# EAGLE design Mixer-Analog-OPA4134-Rev-M-multi (EAGLE 8.6.0)
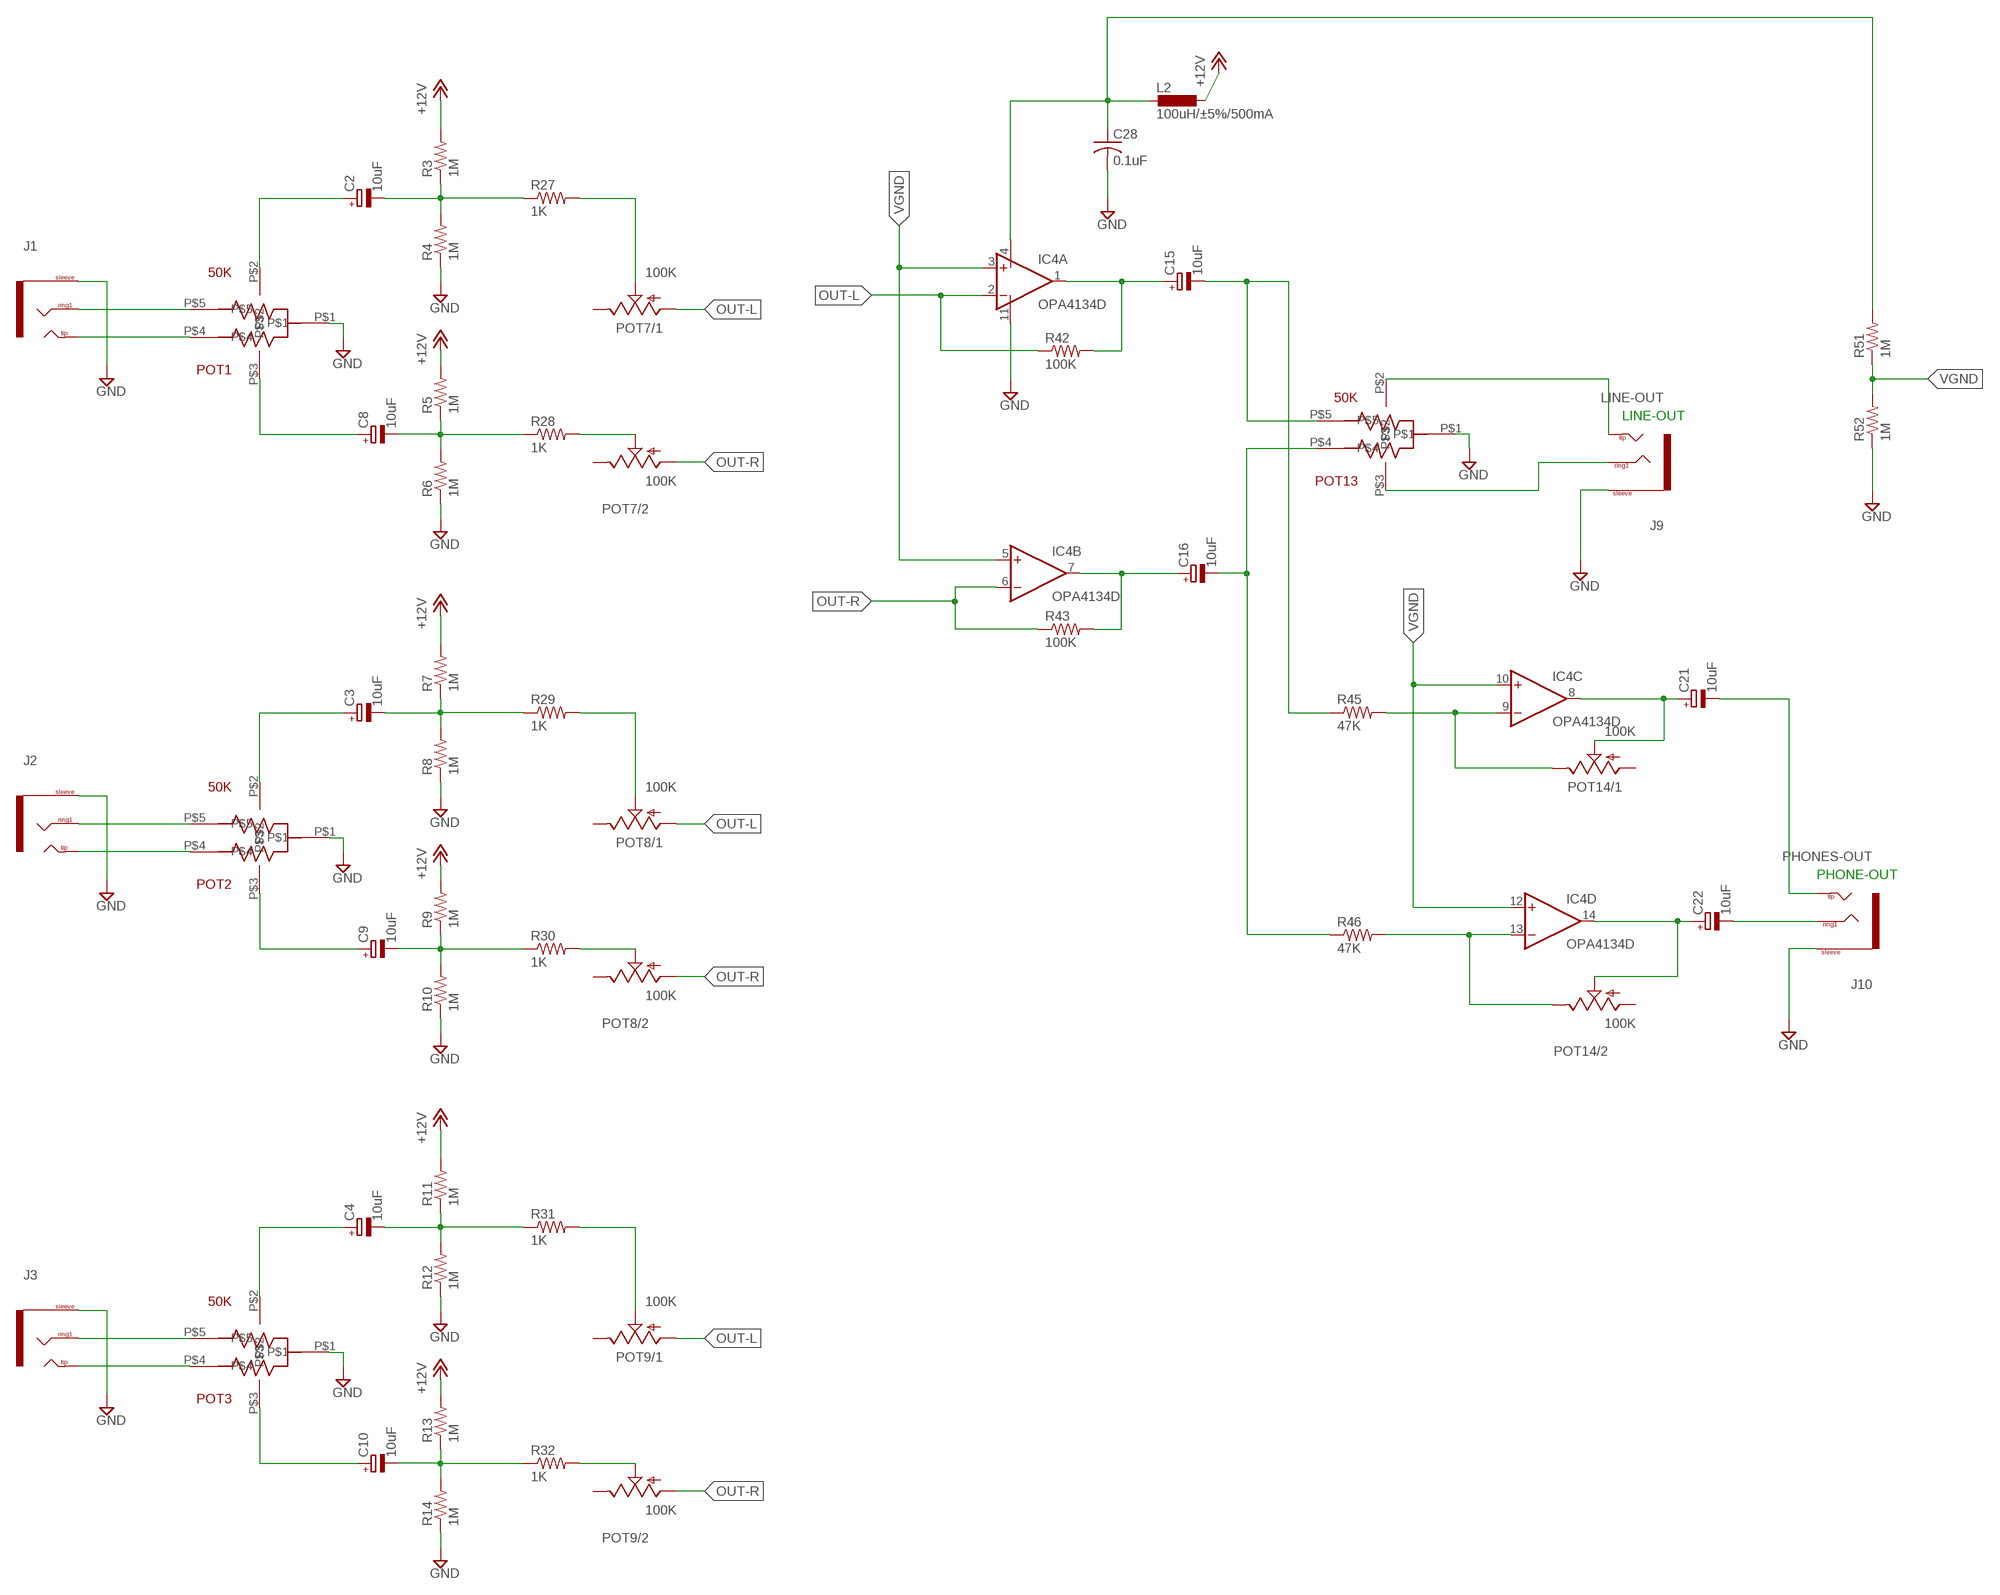
[diagram p0: schematic, sheet 1, part 1 of 2]
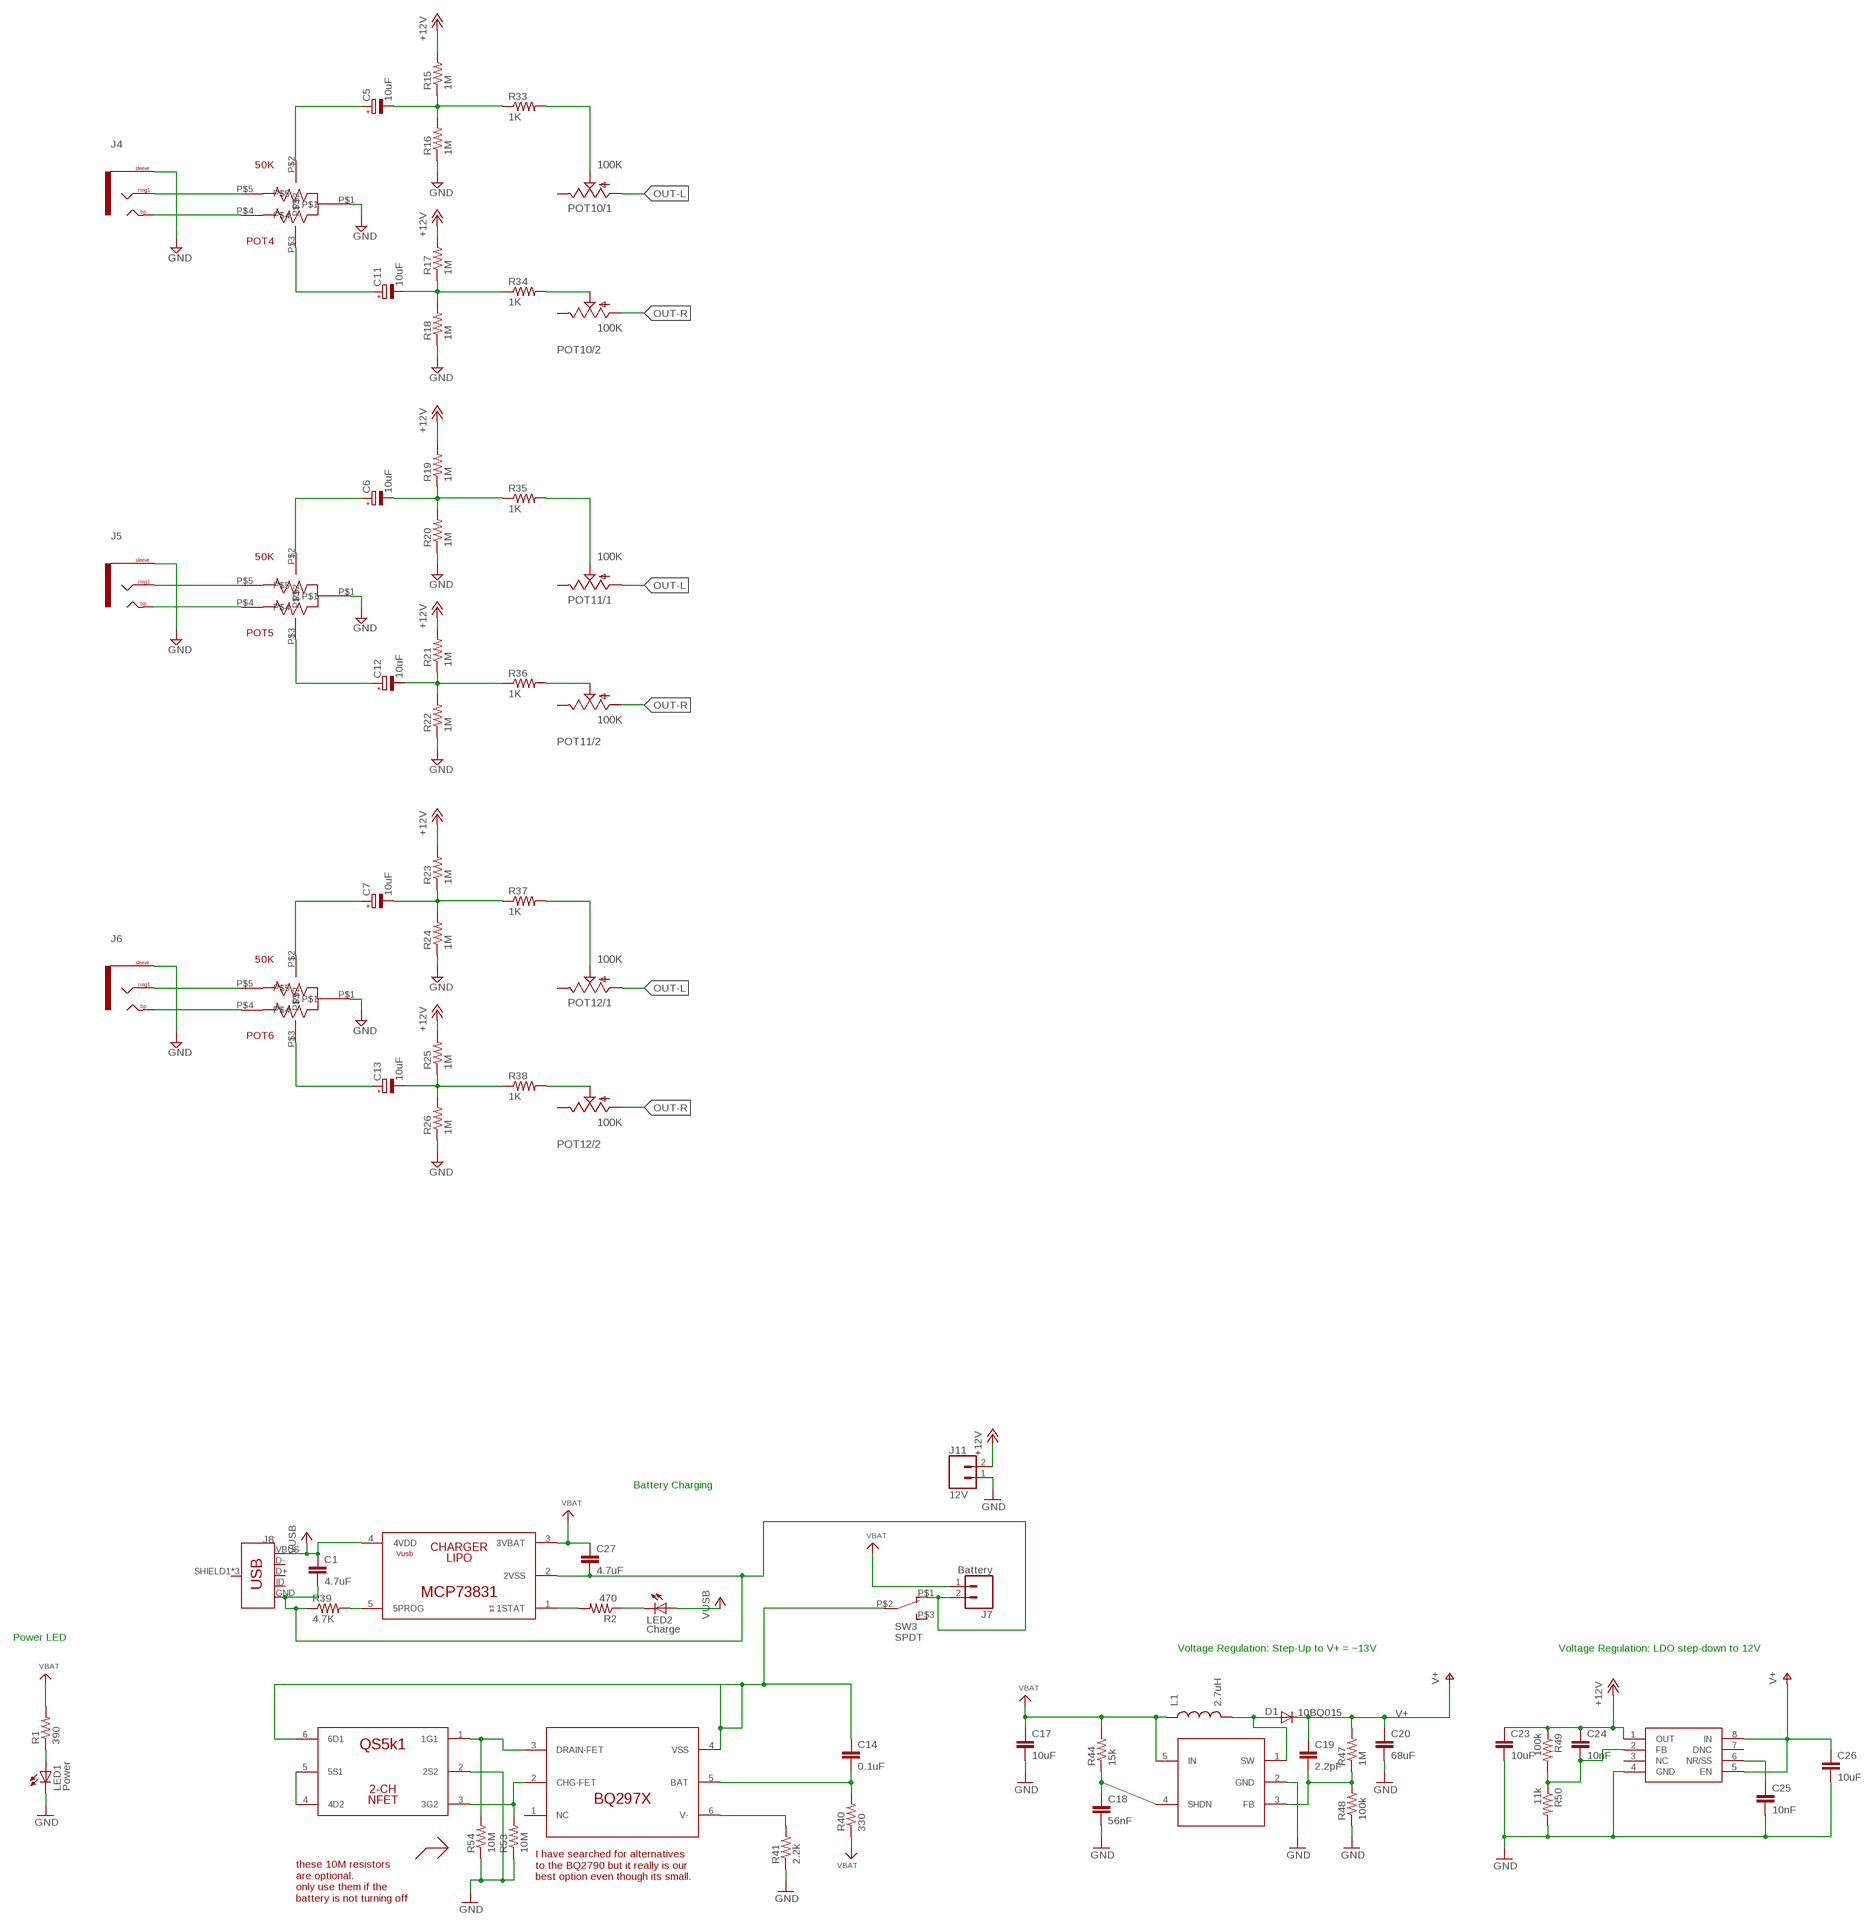
[diagram p1: schematic, sheet 1, part 2 of 2]

## Parts
C1  4.7uF  C-EUC0603  [C0603]
C2  10uF  CPOL-EUB  [PANASONIC_B]
C3  10uF  CPOL-EUB  [PANASONIC_B]
C4  10uF  CPOL-EUB  [PANASONIC_B]
C5  10uF  CPOL-EUB  [PANASONIC_B]
C6  10uF  CPOL-EUB  [PANASONIC_B]
C7  10uF  CPOL-EUB  [PANASONIC_B]
C8  10uF  CPOL-EUB  [PANASONIC_B]
C9  10uF  CPOL-EUB  [PANASONIC_B]
C10  10uF  CPOL-EUB  [PANASONIC_B]
C11  10uF  CPOL-EUB  [PANASONIC_B]
C12  10uF  CPOL-EUB  [PANASONIC_B]
C13  10uF  CPOL-EUB  [PANASONIC_B]
C14  0.1uF  C-EUC0603  [C0603]
C15  10uF  CPOL-EUB  [PANASONIC_B]
C16  10uF  CPOL-EUB  [PANASONIC_B]
C17  10uF  C-EUC0603  [C0603]
C18  56nF  C-EUC0603  [C0603]
C19  2.2pF  C-EUC0603  [C0603]
C20  68uF  C-EUC1206  [C1206]
C21  10uF  CPOL-EUB  [PANASONIC_B]
C22  10uF  CPOL-EUB  [PANASONIC_B]
C23  10uF  C-EUC0603  [C0603]
C24  10nF  C-EUC0603  [C0603]
C25  10nF  C-EUC0603  [C0603]
C26  10uF  C-EUC0603  [C0603]
C27  4.7uF  C-EUC0603  [C0603]
C28  0.1uF  C-USC0805K  [C0805K]
D1  10BQ015  DIODESMA  [SMA-DIODE]
IC1  BQ297X  BQ297X-BATTERY-MANAGERLONG  [WSON-6-LONG]
IC2  MCP73831  [SOT-23-5]
IC3  QS6K1  [SOT457R_PHILIPS]
IC4  OPA4134D  [SO14]
IC5  SC4503  [SOT23-5]
IC6  TPS7A49  [MSOP-8]
J1  TRS-1/8"-3.5MM  [TRS_SJ-3524-SMT]
J2  TRS-1/8"-3.5MM  [TRS_SJ-3524-SMT]
J3  TRS-1/8"-3.5MM  [TRS_SJ-3524-SMT]
J4  TRS-1/8"-3.5MM  [TRS_SJ-3524-SMT]
J5  TRS-1/8"-3.5MM  [TRS_SJ-3524-SMT]
J6  TRS-1/8"-3.5MM  [TRS_SJ-3524-SMT]
J7  Battery  CONN_02LOCK  [1X02_LOCK]
J8  USB_MICRO-BREDUCED_PASTE  [USB-B-MICRO-SMD_RED_PASTE]
J9  LINE-OUT  TRS-1/8"-3.5MM  [TRS_SJ-3524-SMT]
J10  PHONES-OUT  TRS-1/8"-3.5MM  [TRS_SJ-3524-SMT]
J11  12V  CONN_02LOCK  [1X02_LOCK]
L1  2.7uH  INDUCTORCR54-KIT  [CR54-KIT]
L2  100uH/±5%/500mA  L-EUL3225M  [L3225M]
LED1  Power  LED3MM  [LED3MM]
LED2  Charge  LED3MM  [LED3MM]
POT1  50K  POT-DUAL-ALPS-RK10J12E0A0A  [POT-DUAL-ALPS-RK10J12E0A0A]
POT2  50K  POT-DUAL-ALPS-RK10J12E0A0A  [POT-DUAL-ALPS-RK10J12E0A0A]
POT3  50K  POT-DUAL-ALPS-RK10J12E0A0A  [POT-DUAL-ALPS-RK10J12E0A0A]
POT4  50K  POT-DUAL-ALPS-RK10J12E0A0A  [POT-DUAL-ALPS-RK10J12E0A0A]
POT5  50K  POT-DUAL-ALPS-RK10J12E0A0A  [POT-DUAL-ALPS-RK10J12E0A0A]
POT6  50K  POT-DUAL-ALPS-RK10J12E0A0A  [POT-DUAL-ALPS-RK10J12E0A0A]
POT7  100K  POT-DUAL-PTV112-4420  [PTV112]
POT8  100K  POT-DUAL-PTV112-4420  [PTV112]
POT9  100K  POT-DUAL-PTV112-4420  [PTV112]
POT10  100K  POT-DUAL-PTV112-4420  [PTV112]
POT11  100K  POT-DUAL-PTV112-4420  [PTV112]
POT12  100K  POT-DUAL-PTV112-4420  [PTV112]
POT13  50K  POT-DUAL-ALPS-RK10J12E0A0A  [POT-DUAL-ALPS-RK10J12E0A0A]
POT14  100K  POT-DUAL-PTV112-4420  [PTV112]
R1  390  R-US_R0603  [R0603]
R2  470  R-US_R0603  [R0603]
R3  1M  RESISTOR0603-RES  [0603-RES]
R4  1M  RESISTOR0603-RES  [0603-RES]
R5  1M  RESISTOR0603-RES  [0603-RES]
R6  1M  RESISTOR0603-RES  [0603-RES]
R7  1M  RESISTOR0603-RES  [0603-RES]
R8  1M  RESISTOR0603-RES  [0603-RES]
R9  1M  RESISTOR0603-RES  [0603-RES]
R10  1M  RESISTOR0603-RES  [0603-RES]
R11  1M  RESISTOR0603-RES  [0603-RES]
R12  1M  RESISTOR0603-RES  [0603-RES]
R13  1M  RESISTOR0603-RES  [0603-RES]
R14  1M  RESISTOR0603-RES  [0603-RES]
R15  1M  RESISTOR0603-RES  [0603-RES]
R16  1M  RESISTOR0603-RES  [0603-RES]
R17  1M  RESISTOR0603-RES  [0603-RES]
R18  1M  RESISTOR0603-RES  [0603-RES]
R19  1M  RESISTOR0603-RES  [0603-RES]
R20  1M  RESISTOR0603-RES  [0603-RES]
R21  1M  RESISTOR0603-RES  [0603-RES]
R22  1M  RESISTOR0603-RES  [0603-RES]
R23  1M  RESISTOR0603-RES  [0603-RES]
R24  1M  RESISTOR0603-RES  [0603-RES]
R25  1M  RESISTOR0603-RES  [0603-RES]
R26  1M  RESISTOR0603-RES  [0603-RES]
R27  1K  RESISTOR0603-RES  [0603-RES]
R28  1K  RESISTOR0603-RES  [0603-RES]
R29  1K  RESISTOR0603-RES  [0603-RES]
R30  1K  RESISTOR0603-RES  [0603-RES]
R31  1K  RESISTOR0603-RES  [0603-RES]
R32  1K  RESISTOR0603-RES  [0603-RES]
R33  1K  RESISTOR0603-RES  [0603-RES]
R34  1K  RESISTOR0603-RES  [0603-RES]
R35  1K  RESISTOR0603-RES  [0603-RES]
R36  1K  RESISTOR0603-RES  [0603-RES]
R37  1K  RESISTOR0603-RES  [0603-RES]
R38  1K  RESISTOR0603-RES  [0603-RES]
R39  4.7K  R-US_R0603  [R0603]
R40  330  R-US_R0603  [R0603]
R41  2.2k  R-US_R0603  [R0603]
R42  100K  RESISTOR0603-RES  [0603-RES]
R43  100K  RESISTOR0603-RES  [0603-RES]
R44  15k  R-US_R0603  [R0603]
R45  47K  RESISTOR0603-RES  [0603-RES]
R46  47K  RESISTOR0603-RES  [0603-RES]
R47  1M  R-US_R0603  [R0603]
R48  100k  R-US_R0603  [R0603]
R49  100k  R-US_R0603  [R0603]
R50  11k  R-US_R0603  [R0603]
R51  1M  RESISTOR0603-RES  [0603-RES]
R52  1M  RESISTOR0603-RES  [0603-RES]
R53  10M  R-US_R0603  [R0603]
R54  10M  R-US_R0603  [R0603]
SW3  SPDT  SWITCH_SPDTCL-SB-12B  [SWITCH_SPDT_CL-SB-12B]

## Nets
+5V: C1.1 IC2.4(4VDD) J8.VBUS LED2.A ; supply symbol labelled VUSB
+12V: C23.1 C24.1 IC6.1(OUT) J11.2 L2.1 R3.2 R5.2 R7.2 R9.2 R11.2 R13.2 R15.2 R17.2 R19.2 R21.2 R23.2 R25.2 R49.1
BATGND: C14.1 IC1.4(VSS) IC3.6(6D1) SW3.P$2
GND: C17.2 C18.2 C20.2 C23.2 C25.2 C26.2 C28.2 IC3.2(2S2) IC4.11(P:V-) IC6.4(GND) J1.1(SLEEVE) J2.1(SLEEVE) J3.1(SLEEVE) J4.1(SLEEVE) J5.1(SLEEVE) J6.1(SLEEVE) J9.1(SLEEVE) J10.1(SLEEVE) J11.1 LED1.K(C) POT1.P$1 POT2.P$1 POT3.P$1 POT4.P$1 POT5.P$1 POT6.P$1 POT13.P$1 R4.1 R6.1 R8.1 R10.1 R12.1 R14.1 R16.1 R18.1 R20.1 R22.1 R24.1 R26.1 R41.1 R48.1 R50.2 R52.1 R53.1 R54.1
N$1: C8.+ POT1.P$3
N$2: LED2.K(C) R2.1
N$3: C8.- R5.1 R6.2 R28.1
N$4: C14.2 IC1.5(BAT) R40.2
N$5: J1.3(RING1) POT1.P$5
N$6: IC2.5(5PROG) R39.2
N$7: C15.+ IC4.1(A:OUT) R42.2
N$8: C2.+ POT1.P$2
N$9: J1.2(TIP) J1.4(TIP) POT1.P$4
N$10: IC2.1(1STAT) R2.2
N$11: IC3.4(4D2) IC3.5(5S1)
N$12: IC1.3(DRAIN-FET) IC3.1(1G1) R54.2
N$13: C2.- R3.1 R4.2 R27.1
N$14: IC1.2(CHG-FET) IC3.3(3G2) R53.2
N$15: IC4.13(D:-IN) POT14.2.3(/2:E) R46.2
N$16: J9.2(TIP) J9.4(TIP) POT13.P$2
N$17: C16.+ IC4.7(B:OUT) R43.2
N$18: J9.3(RING1) POT13.P$3
N$19: POT7.2.2(/2:S) R28.2
N$21: C22.- J10.3(RING1)
N$22: C9.- R9.1 R10.2 R30.1
N$23: C21.- J10.2(TIP) J10.4(TIP)
N$24: C21.+ IC4.8(C:OUT) POT14.1.2(/1:S)
N$25: C22.+ IC4.14(D:OUT) POT14.2.2(/2:S)
N$26: J2.3(RING1) POT2.P$5
N$27: POT8.1.2(/1:S) R29.2
N$28: C9.+ POT2.P$3
N$29: C3.+ POT2.P$2
N$30: J2.2(TIP) J2.4(TIP) POT2.P$4
N$31: C3.- R7.1 R8.2 R29.1
N$32: POT8.2.2(/2:S) R30.2
N$33: C28.1 IC4.4(P:V+) L2.2 R51.2
N$34: IC1.6(V-) R41.2
N$41: C10.- R13.1 R14.2 R32.1
N$42: J3.3(RING1) POT3.P$5
N$43: POT9.1.2(/1:S) R31.2
N$44: C10.+ POT3.P$3
N$45: C4.+ POT3.P$2
N$46: J3.2(TIP) J3.4(TIP) POT3.P$4
N$47: C4.- R11.1 R12.2 R31.1
N$48: POT9.2.2(/2:S) R32.2
N$55: POT7.1.2(/1:S) R27.2
N$58: C11.- R17.1 R18.2 R34.1
N$59: J4.3(RING1) POT4.P$5
N$60: POT10.1.2(/1:S) R33.2
N$61: C15.- POT13.P$5 R45.1
N$62: C11.+ POT4.P$3
N$63: C5.+ POT4.P$2
N$64: J4.2(TIP) J4.4(TIP) POT4.P$4
N$65: C5.- R15.1 R16.2 R33.1
N$66: POT10.2.2(/2:S) R34.2
N$75: C12.- R21.1 R22.2 R36.1
N$76: J5.3(RING1) POT5.P$5
N$77: POT11.1.2(/1:S) R35.2
N$78: C12.+ POT5.P$3
N$79: C6.+ POT5.P$2
N$80: J5.2(TIP) J5.4(TIP) POT5.P$4
N$81: C6.- R19.1 R20.2 R35.1
N$82: POT11.2.2(/2:S) R36.2
N$91: C13.- R25.1 R26.2 R38.1
N$92: J6.3(RING1) POT6.P$5
N$93: POT12.1.2(/1:S) R37.2
N$94: C13.+ POT6.P$3
N$95: C7.+ POT6.P$2
N$96: J6.2(TIP) J6.4(TIP) POT6.P$4
N$97: C7.- R23.1 R24.2 R37.1
N$98: POT12.2.2(/2:S) R38.2
N$114: LED1.A R1.1
N$115: D1.A IC5.1(SW) L1.P$2
N$116: C18.1 IC5.4(SHDN) R44.1
N$117: C19.2 IC5.3(FB) R47.1 R48.2
N$118: C24.2 IC6.2(FB) R49.2 R50.1
N$119: C25.1 IC6.6(NR/SS)
OUT-L: IC4.2(A:-IN) POT7.1.1(/1:A) POT8.1.1(/1:A) POT9.1.1(/1:A) POT10.1.1(/1:A) POT11.1.1(/1:A) POT12.1.1(/1:A) R42.1
OUT-L1: IC4.9(C:-IN) POT14.1.3(/1:E) R45.2
OUT-R: IC4.6(B:-IN) POT7.2.1(/2:A) POT8.2.1(/2:A) POT9.2.1(/2:A) POT10.2.1(/2:A) POT11.2.1(/2:A) POT12.2.1(/2:A) R43.1
OUT-R1: C16.- POT13.P$4 R46.1
USBGND: C1.2 C27.2 IC2.2(2VSS) J7.2 J8.GND R39.1 SW3.P$1
V+: C19.1 C20.1 C26.1 D1.C IC6.5(EN) IC6.8(IN) R47.2
VBAT: C17.1 C27.1 IC2.3(3VBAT) IC5.5(IN) J7.1 L1.P$1 R1.2 R40.1 R44.2
VGND: IC4.3(A:+IN) IC4.5(B:+IN) IC4.10(C:+IN) IC4.12(D:+IN) R51.1 R52.2
Unconnected: IC1.1(NC) IC5.2(GND) IC6.3(NC) IC6.7(DNC) J8.D+ J8.D- J8.ID J8.SHIELD1(SHIELD) J8.SHIELD2(SHIELD) J8.SHIELD3(SHIELD) POT7.1.3(/1:E) POT7.2.3(/2:E) POT8.1.3(/1:E) POT8.2.3(/2:E) POT9.1.3(/1:E) POT9.2.3(/2:E) POT10.1.3(/1:E) POT10.2.3(/2:E) POT11.1.3(/1:E) POT11.2.3(/2:E) POT12.1.3(/1:E) POT12.2.3(/2:E) POT14.1.1(/1:A) POT14.2.1(/2:A) SW3.P$3

## Notes on the sheet
- LINE-OUT
- PHONE-OUT
- Battery Charging
- Power LED
- Voltage Regulation: Step-Up to V+ = ~13V | Voltage Regulation: LDO step-down to 12V
- I have searched for alternatives 
  to the BQ2790 but it really is our 
  best option even though its small.
- these 10M resistors
  are optional. 
  only use them if the 
  battery is not turning off

## Library data of the parts
C1 C14 C17-C20 C23-C27 = rcl:C-EU: CAPACITOR, European symbol; SPICEPREFIX: C
C2-C13 C15 C16 C21 C22 = CMU-ArtFab:CPOL-EU: POLARIZED CAPACITOR, European symbol
C28 = adafruit:C-US: CAPACITOR, American symbol
D1 = SparkFun:DIODE: Diode These are standard reverse protection diodes and small signal diodes. SMA package can handle up to about 1A. SOD-323 can handle about 200mA. What the SOD-323 package when ordering, there are some mfgs out there that are 5-pin packages.
IC1 = CMU-ArtFab:BQ297X-BATTERY-MANAGER
IC2 = CMU-ArtFab:MCP73831
IC3 = CMU-ArtFab:QS6K1
IC4 = linear:OPA4134: SoundPLUS (TM) High Performance AUDIO OPERATIONAL AMPLIFIERS Source: http://focus.ti.com/lit/ds/sbos058/sbos058.pdf
IC5 = CMU-ArtFab:SC4503
IC6 = CMU-ArtFab:TPS7A49
J1-J6 J9 J10 = CMU-ArtFab:TRS-1/8"-3.5MM
J7 J11 = SparkFun-Connectors:CONN_02: Multi connection point. Often used as Generic Header-pin footprint for 0.1 inch spaced/style header connections On any of the 0.1 inch spaced packages, you can populate with these: Break Away Headers - Straight <https://www.sparkfun.com/products/116> (PRT-00116) Break Away Male Headers - Right Angle <https://www.sparkfun.com/products/553> (PRT-00553) Female Headers <https://www.sparkfun.com/products/115> (PRT-00115) Break Away Headers - Machine Pin <https://www.sparkfun.com/products/117> (PRT-00117) Break Away Female Headers - Swiss Machine Pin <https://www.sparkfun.com/products/743> (PRT-00743) For SCREWTERMINALS and SPRING TERMINALS visit here: Screw Terimnals on SparkFun.com <https://www.sparkfun.com/search/results?term=Screw+Terminals> (5mm/3.5mm/2.54mm spacing) This device is also useful as a general connection point to wire up your design to another part of your project. Our various solder wires solder well into these plated through hole pads. Hook-Up Wire - Assortment (Stranded, 22 AWG) <https://www.sparkfun.com/products/11375> (PRT-11375) Hook-Up Wire - Assortment (Solid Core, 22 AWG) <https://www.sparkfun.com/products/11367> (PRT-11367) View the entire wire category on our website here <https://www.sparkfun.com/categories/141> Special notes: Molex polarized connector foot print use with: PRT-08233 with associated crimp pins and housings. 2.54_SCREWTERM for use with PRT-10571. 3.5mm Screw Terminal footprints for PRT-08084 5mm Screw Terminal footprints for use with PRT-08432
J8 = CMU-ArtFab:USB_MICRO-B: USB Type Micro-B Connector Male/female and PTH/SMT variants SparkFun Products: SparkFun microB USB Breakout <https://www.sparkfun.com/products/12035> SparkFun USB microB Plug Breakout <https://www.sparkfun.com/products/10031> SparkFun ESP8266 Thing <https://www.sparkfun.com/products/13231>; PROD_ID: CONN-11752
L1 = SparkFun-Passives:INDUCTOR: Inductors Basic Inductor/Choke - 0603 and 1206. Footprints are not proven and vary greatly between part numbers. SRN6045- 33uH, 20% 1.4A SDR0403-560KL - 56uH, 10%, 500mA RMS/740mA peak
L2 = rcl:L-EU: INDUCTOR, European symbol; SPICEPREFIX: L
LED1 LED2 = led:LED: LED OSRAM: - CHIPLED LG R971, LG N971, LY N971, LG Q971, LY Q971, LO R971, LY R971 LH N974, LH R974 LS Q976, LO Q976, LY Q976 LO Q996 - Hyper CHIPLED LW Q18S LB Q993, LB Q99A, LB R99A - SideLED LS A670, LO A670, LY A670, LG A670, LP A670 LB A673, LV A673, LT A673, LW A673 LH A674 LY A675 LS A676, LA A676, LO A676, LY A676, LW A676 LS A679, LY A679, LG A679 - Hyper Micro SIDELED® LS Y876, LA Y876, LO Y876, LY Y876 LT Y87S - SmartLED LW L88C, LW L88S LB L89C, LB L89S, LG L890 LS L89K, LO L89K, LY L89K LS L896, LA L896, LO L896, LY L896 - TOPLED LS T670, LO T670, LY T670, LG T670, LP T670 LSG T670, LSP T670, LSY T670, LOP T670, LYG T670 LG T671, LOG T671, LSG T671 LB T673, LV T673, LT T673, LW T673 LH T674 LS T676, LA T676, LO T676, LY T676, LB T676, LH T676, LSB T676, LW T676 LB T67C, LV T67C, LT T67C, LS T67K, LO T67K, LY T67K, LW E67C LS E67B, LA E67B, LO E67B, LY E67B, LB E67C, LV E67C, LT E67C LW T67C LS T679, LY T679, LG T679 LS T770, LO T770, LY T770, LG T770, LP T770 LB T773, LV T773, LT T773, LW T773 LH T774 LS E675, LA E675, LY E675, LS T675 LS T776, LA T776, LO T776, LY T776, LB T776 LHGB T686 LT T68C, LB T68C - Hyper Mini TOPLED® LB M676 - Mini TOPLED Santana® LG M470 LS M47K, LO M47K, LY M47K Source: http://www.osram.convergy.de LUXEON: - LUMILED® LXK2-PW12-R00, LXK2-PW12-S00, LXK2-PW14-U00, LXK2-PW14-V00 LXK2-PM12-R00, LXK2-PM12-S00, LXK2-PM14-U00 LXK2-PE12-Q00, LXK2-PE12-R00, LXK2-PE12-S00, LXK2-PE14-T00, LXK2-PE14-U00 LXK2-PB12-K00, LXK2-PB12-L00, LXK2-PB12-M00, LXK2-PB14-N00, LXK2-PB14-P00, LXK2-PB14-Q00 LXK2-PR12-L00, LXK2-PR12-M00, LXK2-PR14-Q00, LXK2-PR14-R00 LXK2-PD12-Q00, LXK2-PD12-R00, LXK2-PD12-S00 LXK2-PH12-R00, LXK2-PH12-S00 LXK2-PL12-P00, LXK2-PL12-Q00, LXK2-PL12-R00 Source: www.luxeon.com KINGBRIGHT: KA-3528ASYC Source: www.kingbright.com
POT1-POT6 POT13 = CMU-ArtFab:POT-DUAL-ALPS-RK10J12E0A0A
POT7-POT12 POT14 = CMU-ArtFab:POT-DUAL-PTV112: Bourns 11mm dual potentiometer; AVAILABILITY: Unavailable; DESCRIPTION: Alt# Tce-10111410; MF: STMicroelectronics; MP: PTV112; PACKAGE: None; PRICE: None; SPICEPREFIX: J
R1 R2 R39-R41 R44 R47-R50 R53 R54 = CMU-ArtFab:R-US_: RESISTOR, American symbol
R3-R38 R42 R43 R45 R46 = SparkFun-Passives:RESISTOR: Resistor Basic schematic elements and footprints for 0603, 1206, and PTH resistors.; SPICEPREFIX: R
R51 R52 = SparkFun-Passives:RESISTOR: Resistor Basic schematic elements and footprints for 0603, 1206, and PTH resistors.
SW3 = CMU-ArtFab:SWITCH_SPDT

## Board
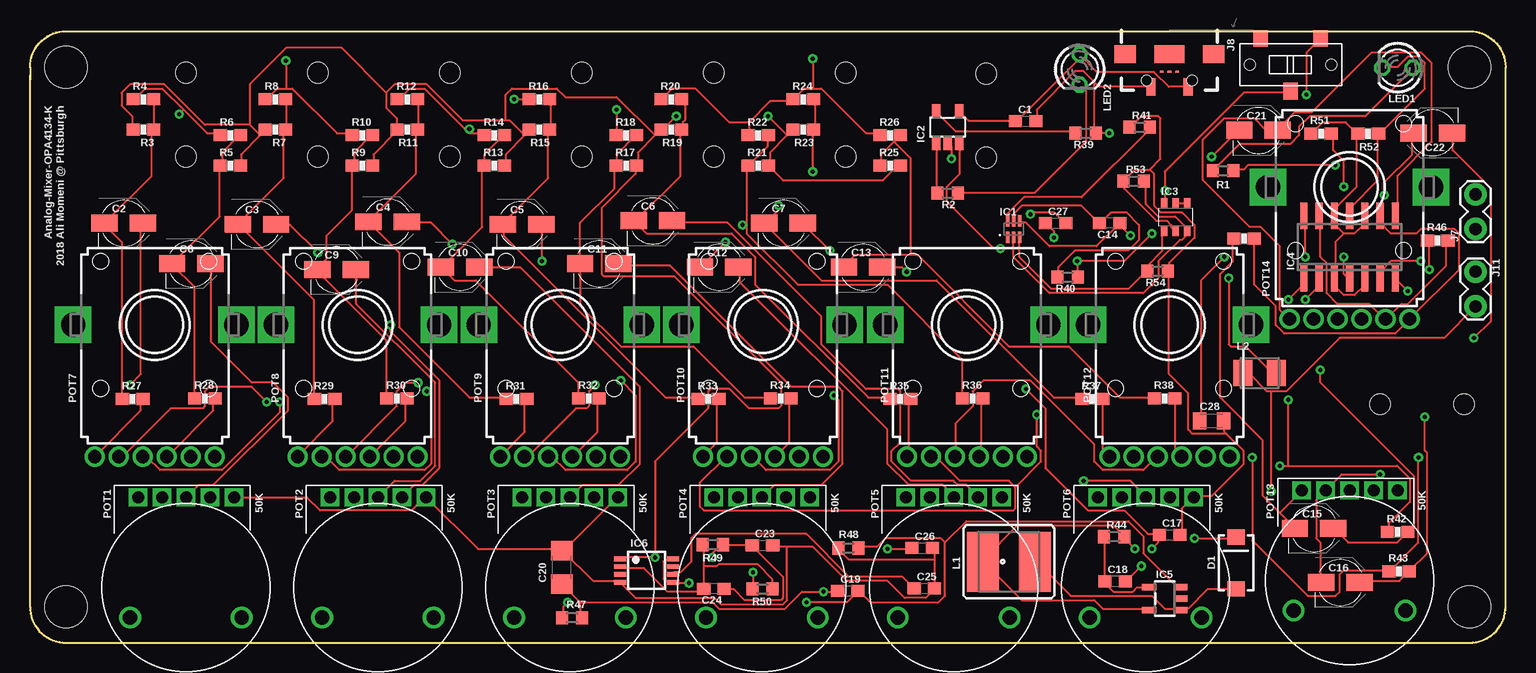
[diagram p2: board, top side]
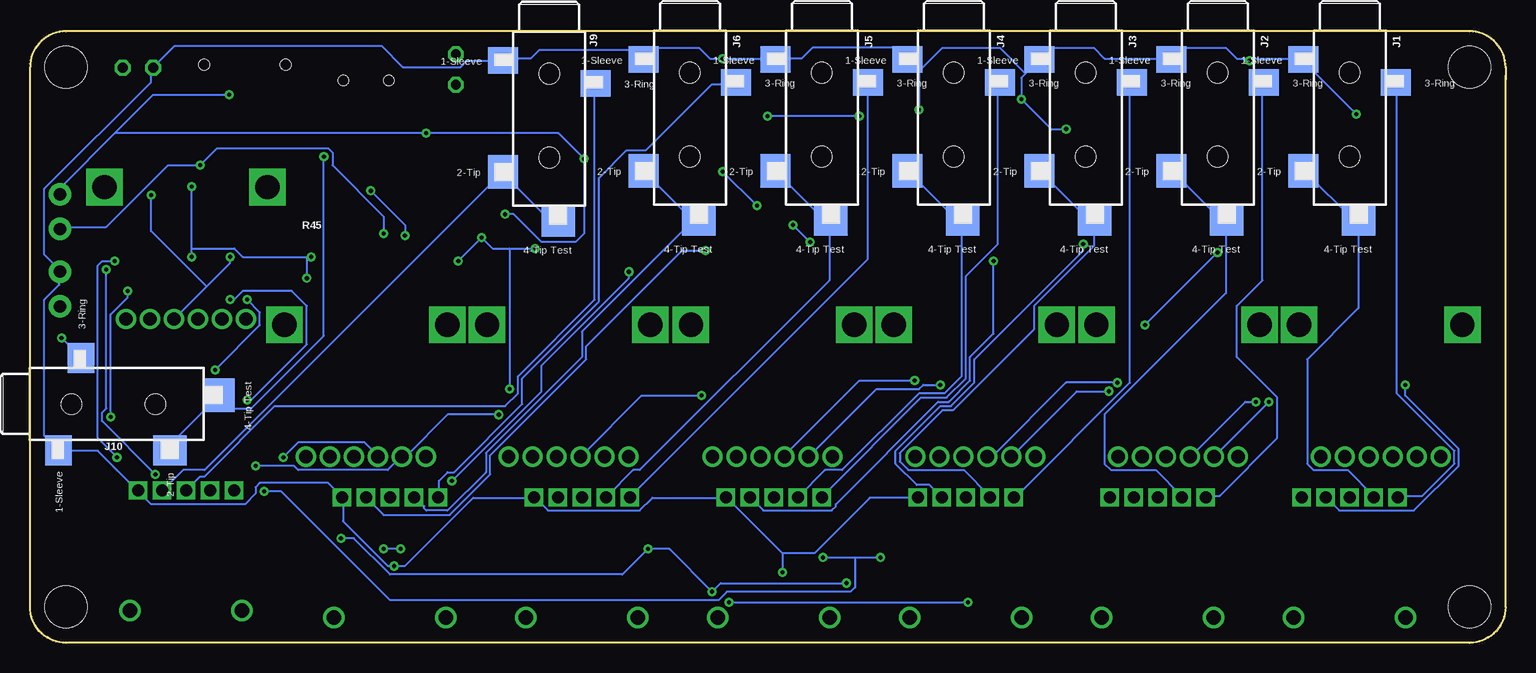
[diagram p3: board, bottom side, seen from below]

Size 123 x 51 mm. Coordinates in mm from the lower left corner, seen from the top.
Outline: 0,47 0,47.3
Outline: 0,47 0,48 arc-90 3,51 120,51 arc-90 123,48 123,3 arc-90 120,0 3,0 arc-90 0,3 0,47
Copper layers (1*16): Top 0.035mm / dielectric 1.5mm / Bottom 0.035mm
Design rules "default *": minimum track width 6mil, minimum drill 0.35mm, track to track 8mil, track to pad 8mil, pad to pad 8mil, via to via 8mil, smd to smd 8mil, copper to edge 40mil, drill to drill 6mil, minimum pad ring 10mil, minimum via ring 8mil, stop-mask expansion 4mil, vias tented up to drill 0mil, thermal gap 10mil
Holes 3.5 mm at 3,48 3,3 120,3 120,48

### Footprints (pad centres in the part's own frame; a part is rotated, then mirrored left to right if it is on the bottom)
C0603 = smd 1.1 x 1: 1 -0.85,0; 2 0.85,0
PANASONIC_B = smd 2.2 x 1.4: + 1.6,0; - -1.6,0
C1206 = smd 1.6 x 1.8: 1 -1.4,0; 2 1.4,0
C0805K = smd 1.1 x 1.4: 1 -1,0; 2 1,0
SMA-DIODE = smd 1.27 x 1.47: A -2.15,0; C 2.15,0
WSON-6-LONG = smd 0.3 x 0.954: 1 -0.5,-0.686; 2 0,-0.686; 3 0.5,-0.686; 4 0.5,0.686; 5 0,0.686; 6 -0.5,0.686
SOT-23-5 = smd 0.69 x 1.2: 1 -0.95,-1.3; 2 0,-1.3; 3 0.95,-1.3; 4 0.95,1.3; 5 -0.95,1.3
SOT457R_PHILIPS = smd 0.55 x 0.8: 1 -0.95,-1.2; 2 0,-1.2; 3 0.95,-1.2; 4 0.95,1.2; 5 0,1.2; 6 -0.95,1.2
SO14 = smd 0.6 x 2.2: 1 -3.81,-2.6; 2 -2.54,-2.6; 3 -1.27,-2.6; 4 0,-2.6; 5 1.27,-2.6; 6 2.54,-2.6; 7 3.81,-2.6; 8 3.81,2.6; 9 2.54,2.6; 10 1.27,2.6; 11 0,2.6; 12 -1.27,2.6; 13 -2.54,2.6; 14 -3.81,2.6
SOT23-5 = smd 0.55 x 1.2: 1 -0.95,-1.3; 2 0,-1.3; 3 0.95,-1.3; 4 0.95,1.3; 5 -0.95,1.3
MSOP-8 = smd 0.4 x 1: 1 -0.975,-2.2; 2 -0.325,-2.2; 3 0.325,-2.2; 4 0.975,-2.2; 5 0.975,2.2; 6 0.325,2.2; 7 -0.325,2.2; 8 -0.975,2.2
TRS_SJ-3524-SMT = smd 2.5 x 2.2: 1 3.85,-4.6; 3 -3.85,-2.7 | smd 2.5 x 2.8: 2 3.85,4.7 | smd 2.8 x 2.5: 4 -0.75,8.85 | hole 1.7: 0,-3.5; 0,3.5
1X02_LOCK = drill 1.016 pad 1.88: 1 -0.178,0; 2 2.718,0
USB-B-MICRO-SMD_RED_PASTE = smd 0.152 x 0.305: D+ 1.455,0; D- 1.455,0.65; ID 1.455,-0.65 | smd 1.45 x 0.762: GND 2.725,-1.554 | smd 1.5 x 1.8: SHIELD1 0,3.685; SHIELD2 0,-3.685 | smd 1.5 x 2.5: SHIELD3 0,0 | smd 1.45 x 0.781: VBUS 2.725,1.554 | hole 0.85: 2.2,1.9; 2.2,-1.9
CR54-KIT = smd 5 x 2.65: P$1 0,2.17; P$2 0,-2.17
L3225M = smd 1.6 x 2.2: 1 -1.4,0; 2 1.4,0
LED3MM = drill 0.813 octagon: A -1.27,0; K 1.27,0
POT-DUAL-ALPS-RK10J12E0A0A = drill 1 pad 1.321 square: P$1 -4,0; P$2 -2,0; P$3 0,0; P$4 2,0; P$5 4,0 | drill 1.2: P$6 4.65,10; P$7 -4.65,10
PTV112 = drill 1.1 pad 1.676: 1.1 -3,-11; 1.2 -5,-11; 1.3 5,-11; 2.1 -1,-11; 2.2 1,-11; 2.3 3,-11 | drill 2.032 pad 2.8 square: M1 -6.8,0; M2 6.8,0
R0603 = smd 1 x 1.1: 1 -0.85,0; 2 0.85,0
0603-RES = smd 1.1 x 1: 1 -0.85,0; 2 0.85,0
SWITCH_SPDT_CL-SB-12B = smd 1.2 x 1.4: P$1 -2.5,-2.2; P$2 0,2.2; P$3 2.5,-2.2 | hole 0.9: -3.4,0; 3.4,0

### Placement (x,y rotation side)
C1  83,43.5 0 top
C2  7.82,35 0 top
C3  18.92,34.9 0 top
C4  29.82,35.1 0 top
C5  41.02,34.9 0 top
C6  51.92,35.2 0 top
C7  62.82,35 0 top
C8  13.45,31.63 0 top
C9  25.55,31.13 0 top
C10  35.85,31.33 0 top
C11  47.45,31.63 0 top
C12  57.45,31.33 0 top
C13  69.45,31.33 0 top
C14  90,35 180 top
C15  107.04,9.54 0 top
C16  109.23,5.04 0 top
C17  95,9 0 top
C18  90.46,5.14 0 top
C19  68.18,4.33 0 top
C20  44.33,6.29 90 top
C21  102.41,42.74 0 top
C22  116.93,42.51 180 top
C23  61.06,8.13 0 top
C24  57.01,4.52 180 top
C25  74.55,4.54 0 top
C26  74.38,7.9 0 top
C27  85.5,35 0 top
C28  98.5,18.5 0 top
D1  100.53,6.66 90 top
IC1  82,34.5 0 top
IC2  76.5,43 0 top
IC3  95.5,35.5 0 top
IC4  110,33 0 top
IC5  94.59,3.69 90 top
IC6  51.39,6.03 270 top
J1  13,44.04 180 bottom
J2  24,44.04 180 bottom
J3  35,44.04 180 bottom
J4  46,44.04 180 bottom
J5  57,44.04 180 bottom
J6  68,44.04 180 bottom
J7  120.5,34.68 90 top
J8  94.98,49.09 270 top
J9  79.72,43.96 180 bottom
J10  116.04,19.9 270 bottom
J11  120.5,30.77 270 top
L1  81.6,6.77 90 top
L2  102.5,22.5 0 top
LED1  114,47.95 180 top
LED2  87.5,47.81 270 top
POT1  13,12.12 180 top
POT2  29,12.12 180 top
POT3  45,12.12 180 top
POT4  61,12.12 180 top
POT5  77,12.12 180 top
POT6  93,12.12 180 top
POT7  10.4,26.52 0 top
POT8  27.3,26.52 0 top
POT9  44.2,26.52 0 top
POT10  61.1,26.52 0 top
POT11  78.1,26.52 0 top
POT12  95,26.52 0 top
POT13  110,12.7 180 top
POT14  110,38 0 top
R1  99.46,39.37 0 top
R2  76.5,37.5 180 top
R3  9.46,42.8 180 top
R4  9.46,45.32 0 top
R5  16.7,39.79 0 top
R6  16.72,42.32 0 top
R7  20.46,42.8 180 top
R8  20.46,45.32 0 top
R9  27.7,39.79 0 top
R10  27.72,42.32 0 top
R11  31.46,42.8 180 top
R12  31.46,45.32 0 top
R13  38.7,39.79 0 top
R14  38.72,42.32 0 top
R15  42.46,42.8 180 top
R16  42.46,45.32 0 top
R17  49.7,39.79 0 top
R18  49.72,42.32 0 top
R19  53.46,42.8 180 top
R20  53.46,45.32 0 top
R21  60.7,39.79 0 top
R22  60.72,42.32 0 top
R23  64.46,42.8 180 top
R24  64.46,45.32 0 top
R25  71.7,39.79 0 top
R26  71.72,42.32 0 top
R27  8.56,20.33 0 top
R28  14.59,20.38 0 top
R29  24.56,20.33 0 top
R30  30.59,20.38 0 top
R31  40.56,20.33 0 top
R32  46.59,20.38 0 top
R33  56.56,20.33 0 top
R34  62.59,20.38 0 top
R35  72.56,20.33 0 top
R36  78.59,20.38 0 top
R37  88.56,20.33 0 top
R38  94.59,20.38 0 top
R39  88,42.5 180 top
R40  86.5,30.5 180 top
R41  92.5,43 0 top
R42  114,9.24 0 top
R43  114.14,5.97 0 top
R44  90.38,8.86 0 top
R45  101.2,33.72 0 top
R46  117.35,33.55 0 top
R47  45.19,2.1 0 top
R48  68.23,7.9 0 top
R49  56.91,8.18 180 top
R50  61.06,4.5 180 top
R51  107.61,42.46 0 top
R52  111.56,42.44 180 top
R53  92,38.5 0 top
R54  94,31 180 top
SW3  105.09,48.21 180 top

### Tracks (layer width: path | path; a pad name or v marks a point on that pad's centre or on a via)
+5V
  Top 0.152: IC2.4 77.52,44.27 78.23,43.56 82.14,43.56 C1.1 82.32,43.56 87.48,48.72 87.48,49.07 | 87.48,49.07 LED2.A | J8.VBUS 94.94,46.36 93.7,47.6 88.95,47.6 87.48,49.07
+12V  (via drill 0.35)
  Top 0.152: 103.48,20.98 104.72,20.98 109.17,25.43 117.88,25.43 120.37,27.91 J11.2 | 103.48,20.98 103.12,20.98 101.7,22.4 101.17,22.4 L2.1 | 19.2,42.32 19.56,42.67 R7.2 19.2,42.32 | 19.2,42.32 17.6,40.72 17.6,39.83 R5.2 | 18.31,43.2 14.58,43.2 11.2,46.58 8.36,46.58 7.64,45.87 7.64,44.81 8.53,43.92 8.53,42.85 R3.2 | 19.2,42.32 18.31,43.2 | C24.1 57.96,4.45 58.67,4.45 59.56,3.56 62.59,3.56 62.76,3.73 62.76,5.51 60.27,8 C23.1 60.1,8.18 57.78,8.18 R49.1 57.61,8.18 56.9,7.47 v56.9,7.11 | IC6.1 49.25,7.11 v52.09,7.11 52.09,15.11 56.54,19.56 56.54,20.98 56.72,21.16 58.32,21.16 59.92,19.56 62.41,19.56 62.59,19.74 62.59,21.69 53.7,30.58 47.83,30.58 47.65,30.76 47.65,36.27 50.49,39.12 50.49,39.65 R17.2 50.67,39.83 50.67,40.89 52.09,42.32 | 63.12,42.32 63.48,42.67 R23.2 63.12,42.32 | 63.12,42.32 61.7,40.89 61.7,39.83 R21.2 61.7,39.65 62.76,38.58 71.12,38.58 72.19,39.65 72.54,39.65 R25.2 | 52.09,42.32 52.45,42.67 R19.2 | R9.2 28.63,39.83 28.63,40.72 30.58,42.67 R11.2 30.58,42.85 30.58,43.74 29.69,44.63 29.69,45.87 | 41.25,42.32 41.6,42.67 R15.2 41.25,42.32 | 41.25,42.32 39.65,40.72 39.65,39.83 R13.2 | 29.69,45.87 30.4,46.58 33.07,46.58 36.09,43.56 39.65,43.56 | 39.65,43.56 40.01,43.56 41.25,42.32 | 52.09,42.32 48.9,45.52 44.63,45.52 43.92,46.23 40.18,46.23 39.65,45.7 39.65,43.56 | 52.09,42.32 R19.2 | v61.52,43.92 63.12,42.32 | v53.87,43.92 52.63,42.67 R19.2 | 18.31,43.2 18.31,46.58 21.34,49.61 25.96,49.61 29.69,45.87 | v103.48,12.62 103.48,20.98
  Bottom 0.152: v56.9,7.11 54.23,7.11 | 54.23,7.11 v52.09,7.11 | v53.87,43.92 v61.52,43.92 | v103.48,12.62 102.06,12.62 92.99,3.56 65.61,3.56 64.9,4.27 54.59,4.27 54.23,4.62 54.23,7.11
BATGND  (via drill 0.35)
  Top 0.152: IC1.4 82.5,35.03 83.03,35.03 84.99,33.07 88.9,33.07 90.68,34.85 C14.1 90.86,34.85 v91.75,33.96 | IC3.6 94.59,36.8 v94.59,37.69 94.59,39.29 101.17,45.87 105.08,45.87 SW3.P$2
  Bottom 0.152: v91.75,33.96 91.75,34.85 v94.59,37.69
GND  (via drill 0.35)
  Top 0.152: 59.92,43.38 59.92,42.49 R22.1 | 59.92,43.38 61.7,45.16 63.48,45.16 R24.1 63.65,45.34 64.54,46.23 65.25,46.23 | 65.25,46.23 65.96,46.23 69.7,42.49 70.76,42.49 R26.1 | 59.92,43.38 58.32,43.38 55.47,46.23 53.52,46.23 52.63,45.34 R20.1 | v65.25,48.72 65.25,46.23 | 21.34,46.23 20.62,46.23 19.74,45.34 R8.1 | 21.34,46.23 21.87,46.23 25.6,42.49 26.85,42.49 R10.1 | 12.8,44.45 11.02,46.23 9.6,46.23 8.71,45.34 R4.1 | 12.8,44.45 14.76,42.49 15.82,42.49 R6.1 | v12.45,44.09 12.8,44.45 | v21.34,48.54 21.34,46.23 | 36.45,42.67 32.89,46.23 31.65,46.23 30.76,45.34 R12.1 | 36.45,42.67 36.63,42.49 37.69,42.49 R14.1 | v40.36,45.34 41.6,45.34 R16.1 | v48.9,44.45 48.9,42.49 R18.1 | v36.63,42.85 36.45,42.67 | 75.39,6.93 75.39,7.82 C26.2 | 75.39,6.93 75.39,4.62 C25.2 75.39,4.45 74.68,3.73 72.9,3.73 71.48,5.16 68.1,5.16 65.25,8 63.12,8 | 75.39,6.93 68.28,6.93 67.39,7.82 R48.1 | 63.12,8 62.05,8 C23.2 | v60.27,5.87 60.27,4.62 R50.2 | 44.45,7.64 46.94,5.16 49.07,5.16 IC6.4 49.25,4.98 50.49,3.73 57.07,3.73 57.61,3.2 62.76,3.2 63.12,3.56 63.12,8 | 44.45,7.64 48.9,12.09 POT3.P$1 | 44.45,7.64 C20.2 44.27,7.82 37.34,7.82 33.07,12.09 POT2.P$1 32.89,12.09 31.83,11.02 24.18,11.02 23.11,12.09 17.07,12.09 POT1.P$1 | IC4.11 110.06,35.74 110.06,36.27 112.37,38.58 112.37,42.32 R52.1 112.55,42.49 116.28,46.23 116.28,48.36 115.75,48.9 114.86,48.9 113.97,48.01 112.9,48.01 LED1.K | IC3.2 95.48,34.31 95.12,34.67 95.12,34.85 94.77,35.2 93.88,35.2 91.21,37.87 91.21,38.41 R53.1 91.21,38.58 92.1,39.47 93.34,39.47 | 93.34,39.47 93.7,39.12 93.7,36.45 94.23,35.92 96.01,35.92 97.08,34.85 97.08,33.78 94.94,31.65 94.94,31.11 R54.1 94.94,30.94 94.94,22.4 96.55,20.8 96.55,17.78 96.9,17.42 99.75,17.42
  Top 0.152: 93.34,39.47 94.23,40.36 94.23,43.74 94.06,43.92 92.63,43.92 91.75,43.03 R41.1 | v92.63,6.4 91.39,5.16 C18.2 | C17.2 96.01,9.07 96.01,11.2 96.9,12.09 POT6.P$1 97.08,12.27 98.5,12.27 101.17,14.94 101.17,16 99.75,17.42 | 99.75,17.42 99.57,17.6 99.57,18.49 C28.2
  Bottom 0.152: 21.34,48.72 22.4,48.72 23.29,49.61 26.85,49.61 27.74,48.72 J2.1 27.91,48.72 33.43,48.72 34.31,49.61 37.87,49.61 38.76,48.72 J3.1 38.94,48.54 40.01,47.47 | 21.34,48.72 16.89,48.72 J1.1 16.89,48.54 v12.45,44.09 | 21.34,48.72 v21.34,48.54 | 40.01,47.47 40.36,47.12 v40.36,45.34 37.87,42.85 v36.63,42.85 | 48.9,47.65 v48.9,44.45 | 48.9,47.65 49.78,48.54 J4.1 | 40.01,47.47 42.14,49.61 46.94,49.61 48.9,47.65 | 48.9,47.65 J4.1 | J4.1 49.96,48.72 50.85,49.61 57.78,49.61 58.67,48.72 60.81,48.72 J5.1 60.98,48.72 v65.25,48.72 66.32,48.72 67.21,49.61 70.94,49.61 71.83,48.72 J6.1 72.01,48.72 72.72,49.43 80.54,49.43 81.25,48.72 83.57,48.72 J9.1 83.74,48.54 86.59,48.54 87.12,48.01 91.92,48.01 93.7,49.78 110.95,49.78 112.72,48.01 LED1.K 112.9,47.83 112.9,46.76 121.79,37.87 121.79,32.36 120.55,31.11 J11.1 120.55,30.94 120.55,29.87 121.79,28.63 121.79,17.25 120.73,16.18 J10.1 120.55,16 117.35,16 114.15,12.8 POT13.P$1 113.97,12.62 112.9,11.56 105.08,11.56 104.19,12.45 104.19,12.98 103.83,13.34 98.15,13.34 97.08,12.27 POT6.P$1 96.9,12.09 96.9,10.13 93.17,6.4 v92.63,6.4 91.75,6.4 86.06,12.09 81.08,12.09 POT5.P$1 80.9,12.09 79.83,11.02 72.19,11.02 71.12,12.09 65.08,12.09 POT4.P$1 64.9,12.09 60.27,7.47 | 60.27,7.47 v60.27,5.87 | 60.27,7.47 57.61,7.47 52.98,12.09 49.07,12.09 POT3.P$1
N$1
  Top 0.152: C8.+ 15.11,31.47 15.11,25.07 18.49,21.69 20.27,21.69 21.51,20.45 21.51,19.38 15.29,13.16 14.05,13.16 13.16,12.27 POT1.P$3
N$2
  Top 0.152: R2.1 77.52,37.52 83.74,37.52 88.01,41.78 88.01,46.05 87.66,46.41 LED2.K
N$3
  Top 0.152: R6.2 17.42,42.32 16,40.89 16,39.83 R5.1 15.82,39.65 15.82,35.56 11.91,31.65 C8.- 11.91,31.47 13.69,29.69 13.69,20.45 R28.1
N$4
  Top 0.152: IC1.5 81.97,35.2 81.97,35.74 82.68,36.45 87.66,36.45 89.08,35.03 C14.2 89.26,35.03 90.14,35.92 91.39,35.92 92.46,34.85 92.46,33.6 91.57,32.72 87.12,32.72 85.7,31.29 85.7,30.58 R40.2
N$5
  Bottom 0.152: J1.3 9.07,46.58 9.07,20.8 4.27,16 4.27,14.94 6.93,12.27 8.89,12.27 POT1.P$5
N$6
  Top 0.152: R39.2 87.12,42.67 77.17,42.67 75.56,44.27 IC2.5
N$7  (via drill 0.35)
  Top 0.152: C15.+ 108.81,9.42 109.88,8.36 113.97,8.36 114.68,9.07 R42.2 115.39,9.78 115.39,13.87 107.57,21.69 v107.57,22.76 | v104.9,28.63 106.15,29.87 106.15,30.23 IC4.1
  Bottom 0.152: v104.9,28.63 103.83,27.56 103.83,26.49 v107.57,22.76
N$8  (via drill 0.35)
  Top 0.152: v8.36,21.51 9.25,22.4 9.25,34.85 C2.+
  Bottom 0.152: v8.36,21.51 8.36,20.62 3.91,16.18 3.91,14.76 7.64,11.02 13.87,11.02 14.94,12.09 POT1.P$2
N$9
  Bottom 0.152: J1.2 16.71,39.29 12.62,35.2 12.27,35.2 J1.4 12.27,35.03 12.27,27.91 16.54,23.65 16.54,14.94 16,14.4 13.16,14.4 11.02,12.27 POT1.P$4
N$10
  Top 0.152: R2.2 75.56,37.52 75.56,41.6 IC2.1
N$11
  Top 0.152: IC3.5 95.66,36.63 96.37,36.63 IC3.4
N$12
  Top 0.152: IC3.1 94.41,34.14 94.41,32.72 93.17,31.47 93.17,31.11 R54.2 92.99,30.94 91.57,29.52 85.17,29.52 82.5,32.18 82.5,33.78 IC1.3
N$13
  Top 0.152: R4.2 10.31,45.16 10.31,42.85 R3.1 10.13,42.67 10.13,38.94 6.22,35.03 C2.- 6.22,34.85 7.64,33.43 7.64,20.45 R27.1
N$14
  Top 0.152: R53.2 92.99,38.41 92.99,36.63 94.06,35.56 95.48,35.56 96.37,34.67 96.37,34.31 IC3.3 96.55,34.14 96.01,33.6 95.83,33.6 94.06,31.83 94.06,30.4 92.81,29.16 84.99,29.16 81.97,32.18 81.97,33.78 IC1.2
N$15
  Top 0.152: R46.2 118.06,33.43 118.06,31.47 114.86,28.27 114.33,28.27 113.08,27.03 POT14.2.3 112.9,27.03 111.66,28.27 108.99,28.27 108.1,29.16 108.1,31.65 107.57,32.18 107.57,35.56 IC4.13
N$16
  Bottom 0.152: J9.4 79.12,35.2 79.65,35.2 83.57,39.12 J9.2 83.74,39.12 108.46,14.4 110.24,14.4 111.84,12.8 POT13.P$2
N$17  (via drill 0.35)
  Top 0.152: C16.+ 110.95,5.16 114.15,5.16 114.86,5.87 R43.2 115.04,6.04 116.46,7.47 116.46,15.82 116.28,16 v116.28,18.85 | v114.86,29.34 113.97,30.23 IC4.7
  Bottom 0.152: v114.86,29.34 114.86,28.8 116.28,27.38 v116.28,18.85
N$18
  Bottom 0.152: J9.3 75.92,46.58 75.92,28.63 82.32,22.23 82.32,20.8 83.39,19.74 102.59,19.74 108.46,13.87 108.81,13.87 109.88,12.8 POT13.P$3
N$19
  Top 0.152: R28.2 15.29,20.27 15.29,19.38 11.56,15.65 POT7.2.2
N$21  (via drill 0.35)
  Top 0.152: v120.37,25.43 121.79,26.85 121.79,37.87 118.59,41.07 118.59,42.49 C22.-
  Bottom 0.152: v120.37,25.43 118.77,23.82 J10.3
N$22
  Top 0.152: R10.2 28.45,42.32 27.03,40.89 27.03,39.83 R9.1 26.85,39.65 26.85,36.09 24.71,33.96 24.71,32 24,31.29 C9.- 23.82,31.11 29.69,25.25 29.69,20.45 R30.1
N$23  (via drill 0.35)
  Top 0.152: v98.5,40.54 100.64,42.67 C21.-
  Bottom 0.152: v98.5,40.54 98.5,25.6 104.55,19.56 105.97,19.56 107.04,20.62 J10.4 107.21,20.62 111.3,16.54 111.3,16.18 J10.2
N$24
  Top 0.152: POT14.1.2 104.9,27.03 104.19,27.74 104.19,33.07 102.59,34.67 101.7,34.67 97.79,38.58 97.79,41.96 99.57,43.74 102.06,43.74 102.95,42.85 103.83,42.85 C21.+ 104.01,42.85 105.44,44.27 106.86,44.27 111.84,49.25 115.93,49.25 116.81,48.36 116.81,41.78 113.97,38.94 113.97,35.74 IC4.8
N$25  (via drill 0.35)
  Top 0.152: v106.32,32.18 106.32,35.56 IC4.14 | v112.9,37.34 112.9,38.41 115.21,40.72 115.21,42.49 C22.+
  Bottom 0.152: v106.32,32.18 106.32,31.65 108.28,29.69 | 108.28,29.69 110.95,27.03 POT14.2.2 | v112.9,37.34 112.9,34.31 108.28,29.69
N$26
  Bottom 0.152: J2.3 20.27,46.58 20.27,30.23 22.4,28.09 22.4,23.82 19.02,20.45 19.02,17.07 23.82,12.27 24.89,12.27 POT2.P$5
N$27
  Top 0.152: R29.2 25.25,20.27 25.25,18.49 22.4,15.65 POT8.1.2
N$28
  Top 0.152: C9.+ 27.2,31.11 27.2,28.27 33.78,21.69 33.78,14.76 32.54,13.51 30.4,13.51 29.16,12.27 POT2.P$3
N$29  (via drill 0.35)
  Top 0.152: v24,32.54 21.69,34.85 20.62,34.85 C3.+ | v30.05,26.49 30.05,25.96 34.14,21.87 34.14,14.58 32.72,13.16 32,13.16 31.11,12.27 POT2.P$2
  Bottom 0.152: v30.05,26.49 v24,32.54
N$30
  Bottom 0.152: J2.2 27.74,39.29 23.65,35.2 23.29,35.2 J2.4 23.29,35.03 23.29,29.16 33.43,19.02 33.43,14.94 32.89,14.4 29.16,14.4 27.03,12.27 POT2.P$4
N$31
  Top 0.152: R8.2 21.34,45.16 21.34,42.85 R7.1 21.16,42.67 21.16,38.76 17.42,35.03 C3.- 17.42,34.85 23.65,28.63 23.65,20.45 R29.1
N$32
  Top 0.152: R30.2 31.29,20.27 31.29,18.49 28.45,15.65 POT8.2.2
N$33  (via drill 0.35)
  Top 0.152: v109.53,38.05 109.53,40.18 108.64,41.07 108.64,42.32 R51.2 | v109.53,32.18 109.53,30.76 109.88,30.4 IC4.4 | v99.57,32.18 97.61,30.23 97.61,18.67 C28.1 | v99.92,30.4 99.92,24.89 100.1,24.71 101.35,24.71 103.48,22.58 103.83,22.58 L2.2
  Bottom 0.152: v109.53,32.18 109.53,32.89 | 109.53,32.89 v109.53,38.05 | 99.92,32.18 105.26,32.18 105.97,32.89 109.53,32.89 | 99.92,32.18 v99.92,30.4 | 99.92,32.18 v99.57,32.18
N$34
  Top 0.152: IC1.6 81.43,35.2 81.43,35.74 82.86,37.16 87.66,37.16 93.34,42.85 R41.2
N$41
  Top 0.152: R14.2 39.47,42.32 37.87,40.72 37.87,39.83 R13.1 37.69,39.65 37.69,34.67 34.31,31.29 | 34.31,31.29 35.38,30.23 37.16,30.23 45.7,21.69 45.7,20.45 R32.1 | 34.31,31.29 C10.-
N$42
  Bottom 0.152: J3.3 31.29,46.58 31.29,21.69 40.89,12.09 POT3.P$5
N$43
  Top 0.152: R31.2 41.25,20.27 41.25,17.6 39.29,15.65 POT9.1.2
N$44
  Top 0.152: C10.+ 37.52,31.29 40.89,31.29 50.85,21.34 50.85,14.94 49.07,13.16 46.05,13.16 45.16,12.27 POT3.P$3
N$45  (via drill 0.35)
  Top 0.152: v35.2,33.25 33.43,35.03 31.47,35.03 C4.+
  Bottom 0.152: v35.2,33.25 35.2,32.72 44.27,23.65 44.27,21.69 46.23,19.74 47.12,19.74 50.85,16 50.85,14.94 49.07,13.16 48.01,13.16 47.12,12.27 POT3.P$2
N$46
  Bottom 0.152: J3.2 38.76,39.29 34.67,35.2 34.31,35.2 J3.4 34.31,35.03 34.31,33.07 39.29,28.09 39.29,26.14 46.05,19.38 46.94,19.38 50.49,15.82 50.49,15.11 49.78,14.4 45.16,14.4 43.03,12.27 POT3.P$4
N$47
  Top 0.152: R12.2 32.36,45.16 32.36,42.85 R11.1 32.18,42.67 32.18,39.12 28.27,35.2 C4.- 28.27,35.03 30.76,32.54 30.76,26.31 36.63,20.45 39.65,20.45 R31.1
N$48
  Top 0.152: R32.2 47.3,20.27 47.3,17.6 45.34,15.65 POT9.2.2
N$55
  Top 0.152: R27.2 9.25,20.27 9.25,19.38 5.51,15.65 POT7.1.2
N$58
  Top 0.152: R18.2 50.49,42.32 48.9,40.72 48.9,39.83 R17.1 48.72,39.65 48.72,37.87 45.87,35.03 45.87,31.65 C11.- 45.87,31.47 45.87,28.09 49.25,24.71 55.3,24.71 59.56,20.45 61.7,20.45 R34.1
N$59
  Bottom 0.152: J4.3 42.32,46.58 42.32,33.25 44.98,30.58 44.98,22.05 46.58,20.45 48.72,20.45 56.9,12.27 POT4.P$5
N$60
  Top 0.152: R33.2 57.25,20.27 57.25,16.71 56.19,15.65 POT10.1.2
N$61
  Top 0.152: 104.19,10.85 105.44,9.6 C15.- | 104.19,10.85 102.77,12.27 102.77,16.89 99.21,20.45 99.21,30.76 100.28,31.83 100.28,33.6 R45.1 | 104.19,10.85 105.97,12.62 POT13.P$5
N$62
  Top 0.152: C11.+ 49.07,31.47 53.34,31.47 63.48,21.34 67.39,21.34 67.74,20.98 67.74,14.94 65.96,13.16 62.05,13.16 61.16,12.27 POT4.P$3
N$63  (via drill 0.35)
  Top 0.152: v42.67,31.83 42.67,34.85 C5.+
  Bottom 0.152: v42.67,31.83 42.67,25.78 44.63,23.82 44.63,21.87 46.41,20.09 47.3,20.09 55.83,11.56 55.83,11.38 56.19,11.02 61.87,11.02 62.94,12.09 POT4.P$2
N$64
  Bottom 0.152: J4.2 49.78,39.29 45.7,35.2 45.34,35.2 J4.4 45.34,35.03 45.34,22.23 46.76,20.8 48.9,20.8 55.3,14.4 56.72,14.4 POT4.P$4
N$65
  Top 0.152: R16.2 43.38,45.16 43.38,42.85 R15.1 43.2,42.67 43.2,38.76 39.47,35.03 C5.- 39.47,34.85 39.47,33.96 52.98,20.45 55.65,20.45 R33.1
N$66
  Top 0.152: R34.2 63.3,20.27 63.3,16.71 62.23,15.65 POT10.2.2
N$75  (via drill 0.35)
  Top 0.152: 59.74,34.85 59.74,39.65 R21.1 59.92,39.83 61.52,41.43 61.52,42.32 R22.2 | 59.74,34.85 59.74,34.14 64.01,29.87 71.48,29.87 77.7,23.65 77.7,20.45 R36.1 | v57.96,33.43 56.01,31.47 C12.- | 59.74,34.85 v59.38,34.85
  Bottom 0.152: v59.38,34.85 v57.96,33.43
N$76
  Bottom 0.152: J5.3 53.16,46.58 53.16,32 72.9,12.27 POT5.P$5
N$77
  Top 0.152: R35.2 73.25,20.27 73.25,15.65 POT11.1.2
N$78
  Top 0.152: C12.+ 59.21,31.29 59.21,30.05 71.48,17.78 71.48,14.94 73.25,13.16 76.1,13.16 76.99,12.27 POT5.P$3
N$79
  Top 0.152: C6.+ 53.7,35.03 58.14,35.03 65.96,27.2 65.96,24.89 69.7,21.16 72.36,21.16 72.54,20.98 72.54,16.71 71.83,16 71.83,15.11 73.43,13.51 76.99,13.51 77.34,13.16 78.05,13.16 78.94,12.27 POT5.P$2
N$80
  Bottom 0.152: J5.2 60.81,39.29 56.72,35.2 56.36,35.2 J5.4 56.36,35.03 56.36,30.23 72.19,14.4 72.72,14.4 74.85,12.27 POT5.P$4
N$81
  Top 0.152: R20.2 54.41,45.16 54.59,44.98 54.59,43.56 54.41,43.38 54.41,42.85 R19.1 54.23,42.67 54.23,38.94 50.49,35.2 C6.- 50.49,35.03 51.38,34.14 58.5,34.14 60.45,32.18 60.45,29.87 69.88,20.45 71.65,20.45 R35.1
N$82
  Top 0.152: R36.2 79.3,20.27 79.3,15.82 79.12,15.65 POT11.2.2
N$91
  Top 0.152: 72.01,41.78 72.54,42.32 R26.2 | 72.01,41.78 70.94,40.72 70.94,39.83 R25.1 | 73.43,32.36 68.81,32.36 67.92,31.47 C13.- | 73.43,32.36 73.97,32.36 81.61,24.71 86.59,24.71 90.86,20.45 93.7,20.45 R38.1 | 72.01,41.78 73.43,40.36 73.43,32.36
N$92
  Bottom 0.152: J6.3 64.19,46.58 66.14,46.58 71.65,41.07 73.25,41.07 75.56,38.76 75.56,28.45 81.97,22.05 81.97,19.91 87.66,14.22 88.19,14.22 88.9,13.51 88.9,12.27 POT6.P$5
N$93
  Top 0.152: R37.2 89.43,20.27 89.43,16.18 89.97,15.65 POT12.1.2
N$94  (via drill 0.35)
  Top 0.152: v73.08,30.94 72.72,31.29 71.12,31.29 C13.+ | v87.83,13.51 91.75,13.51 92.99,12.27 POT6.P$3
  Bottom 0.152: v73.08,30.94 73.08,30.4 80.37,23.11 80.37,20.98 v87.83,13.51
N$95  (via drill 0.35)
  Top 0.152: v66.67,32.72 64.54,34.85 C7.+
  Bottom 0.152: v66.67,32.72 68.63,32.72 76.63,24.71 76.63,23.65 84.63,15.65 84.63,14.05 88.01,10.67 93.52,10.67 94.94,12.09 POT6.P$2
N$96
  Bottom 0.152: 67.74,35.2 67.39,35.2 J6.4 67.74,35.2 | 67.74,35.2 71.83,39.29 J6.2 | 67.74,35.2 76.99,25.96 76.99,23.82 84.99,15.82 84.99,14.22 88.19,11.02 89.97,11.02 90.14,11.2 90.14,11.38 90.86,12.09 POT6.P$4
N$97  (via drill 0.35)
  Top 0.152: R24.2 65.43,45.16 65.43,42.85 R23.1 65.25,42.67 v65.25,39.29 | R37.1 87.66,20.45 85.34,20.45 75.56,30.23 65.96,30.23 61.34,34.85 C7.- 61.34,35.03 62.41,36.09 v62.41,36.45
  Bottom 0.152: v62.41,36.45 v65.25,39.29
N$98
  Top 0.152: R38.2 95.48,20.27 95.48,16 95.83,15.65 POT12.2.2
N$114
  Top 0.152: R1.1 98.68,39.47 100.81,41.6 105.08,41.6 105.79,42.32 105.79,43.03 106.68,43.92 111.3,43.92 115.21,47.83 LED1.A
N$115
  Top 0.152: D1.A 100.46,4.45 98.15,4.45 96.55,2.85 96.01,2.85 IC5.1 95.83,2.85 94.59,2.85 93.52,3.91 86.77,3.91 83.92,6.76 L1.P$2
N$116
  Top 0.152: R44.1 89.61,8.71 89.61,5.16 C18.1 89.61,4.98 90.32,4.27 91.92,4.27 92.28,4.62 93.17,4.62 IC5.4
N$117  (via drill 0.35)
  Top 0.152: v44.81,3.38 44.45,3.02 44.45,2.13 R47.1 | v64.72,3.38 68.1,3.38 68.99,4.27 C19.2 69.16,4.27 70.05,3.38 75.74,3.38 76.28,3.91 76.28,8.36 | 76.28,8.36 75.92,8.71 71.3,8.71 70.59,8 69.16,8 R48.2 | 76.28,8.36 78.05,10.13 91.57,10.13 92.81,8.89 92.81,7.47 95.48,4.8 95.83,4.8 IC5.3
  Bottom 0.152: v64.72,3.38 v44.81,3.38
N$118
  Top 0.152: IC6.2 49.25,6.22 51.21,6.22 53.16,4.27 55.83,4.27 56.01,4.45 C24.2 56.19,4.62 56.19,6.4 | 56.19,6.4 56.19,8.18 R49.2 | 56.19,6.4 57.25,6.4 57.43,6.58 60.63,6.58 61.87,5.33 61.87,4.62 R50.1
N$119
  Top 0.152: IC6.6 53.7,5.87 54.23,5.87 55.12,6.76 55.12,8.71 55.47,9.07 64.72,9.07 68.28,5.51 72.72,5.51 73.61,4.62 C25.1
OUT-L  (via drill 0.35)
  Top 0.152: v104.19,14.76 104.9,14.76 | 104.9,14.76 113.97,14.76 115.04,13.69 115.04,11.73 113.26,9.96 113.26,9.25 R42.1 | v106.32,28.63 107.39,29.69 107.39,30.23 IC4.2 | 104.9,14.76 v104.9,20.27 | v19.74,20.09 18.49,21.34 14.94,21.34 14.58,20.98 14.58,19.74 14.4,19.56 11.73,19.56 7.82,15.65 7.47,15.65 POT7.1.1 | v47.12,21.51 46.58,20.98 46.58,19.74 46.41,19.56 45.52,19.56 41.6,15.65 41.25,15.65 POT9.1.1 | 82.14,12.98 81.61,13.51 77.52,13.51 75.56,15.47 75.21,15.47 POT11.1.1 | 82.14,12.98 82.14,11.2 81.97,11.02 56.19,11.02 55.83,11.38 55.83,13.34 57.96,15.47 POT10.1.1 | v33.07,20.98 33.43,20.62 33.43,14.94 32.89,14.4 25.78,14.4 24.71,15.47 24.36,15.47 POT8.1.1 | v83.92,19.02 83.92,16.36 84.28,16 84.28,15.11 82.14,12.98
  Bottom 0.152: v104.19,14.76 100.99,14.76 100.64,14.4 93.17,14.4 92.1,15.47 POT12.1.1 91.92,15.65 91.57,15.65 88.19,19.02 v83.92,19.02 | v106.32,28.63 105.97,28.63 105.26,29.34 101.17,29.34 99.92,28.09 99.92,24.89 104.55,20.27 v104.9,20.27 | v19.74,20.09 24.18,15.65 POT8.1.1 | v47.12,21.51 48.54,21.51 48.9,21.16 52.45,21.16 57.96,15.65 POT10.1.1 | v33.07,20.98 35.74,20.98 41.07,15.65 POT9.1.1
OUT-L1
  Top 0.152: R45.2 102.06,33.6 102.06,29.87 103.83,28.09 103.83,26.49 104.55,25.78 113.79,25.78 114.86,26.85 POT14.1.3 115.04,27.03 119.13,31.11 119.13,34.14 118.77,34.49 115.93,34.49 115.57,34.14 113.44,34.14 112.55,35.03 112.55,35.56 IC4.9
OUT-R  (via drill 0.35)
  Top 0.152: v20.8,20.09 20.8,19.2 16,14.4 10.85,14.4 9.78,15.47 9.42,15.47 POT7.2.1 | v32.36,21.69 31.29,21.69 30.58,20.98 30.58,19.74 26.31,15.47 POT8.2.1 | v67.03,20.62 67.39,20.27 67.39,15.11 66.67,14.4 61.34,14.4 60.27,15.47 POT10.2.1 | v101.88,15.47 101.88,8.53 106.5,3.91 108.81,3.91 109.17,4.27 109.17,5.69 109.53,6.04 113.26,6.04 R43.1 113.44,6.04 115.75,8.36 v115.75,15.47 | v115.93,31.83 113.44,31.83 112.55,30.94 IC4.6 | POT11.2.1 77.17,15.65 77.17,18.31 78.59,19.74 78.59,20.98 79.48,21.87 83.39,21.87 88.72,16.54 88.72,15.11 89.43,14.4 92.81,14.4 93.88,15.47 POT12.2.1 | v49.25,21.87 50.49,20.62 50.49,15.11 49.78,14.4 44.63,14.4 43.56,15.47 43.2,15.47 POT9.2.1
  Bottom 0.152: v20.8,20.09 21.69,20.09 26.14,15.65 POT8.2.1 | v32.36,21.69 36.63,21.69 42.67,15.65 43.03,15.65 POT9.2.1 | v67.03,20.62 72.01,20.62 76.99,15.65 POT11.2.1 | v101.88,15.47 100.64,16.71 95.12,16.71 94.06,15.65 POT12.2.1 | v115.93,31.83 116.99,31.83 117.35,31.47 117.35,17.07 v115.75,15.47 | v49.25,21.87 53.87,21.87 60.1,15.65 POT10.2.1
OUT-R1  (via drill 0.35)
  Top 0.152: v116.64,31.11 116.64,33.43 R46.1 | v112.55,14.05 109.35,14.05 108.1,12.8 POT13.P$4 107.92,12.62 107.21,11.91 107.21,8.71 107.57,8.36 107.57,5.16 C16.-
  Bottom 0.152: v116.64,31.11 116.64,19.56 116.99,19.2 116.99,18.49 v112.55,14.05
USBGND  (via drill 0.35)
  Top 0.152: 88.72,46.76 87.83,47.65 87.12,47.65 83.92,44.45 83.92,43.56 C1.2 | 88.72,46.76 88.72,42.67 R39.1 88.9,42.49 v89.97,42.49 | v83.39,35.74 83.57,35.92 85.34,35.92 86.23,35.03 C27.2 | v76.81,40.36 76.81,41.43 76.63,41.6 IC2.2 | J8.GND 89.12,46.36 88.72,46.76 | SW3.P$1 106.4,49.21 v106.4,45.7
  Bottom 0.152: v83.39,35.74 82.68,35.74 80.37,33.43 77.52,33.43 76.81,34.14 v76.81,40.36 78.94,42.49 v89.97,42.49 115.93,42.49 | 115.93,42.49 120.37,38.05 120.37,37.52 J7.2 | 115.93,42.49 112.72,45.7 v106.4,45.7
V+  (via drill 0.35)
  Top 0.152: IC6.8 53.52,6.93 52.98,6.93 52.81,6.76 52.81,5.33 52.98,5.16 53.52,5.16 IC6.5 53.7,4.98 v54.94,4.98 | 45.87,3.38 45.87,2.13 R47.2 | 45.87,3.38 44.45,4.8 C20.1 | 45.87,3.38 56.9,3.38 57.43,2.85 62.94,2.85 64.36,4.27 v66.14,4.27 67.21,4.27 C19.1 | v71.48,7.82 73.43,7.82 C26.1 | v97.08,8.71 100.46,8.71 D1.C
  Bottom 0.152: v97.08,8.71 96.01,8.71 92.99,5.69 73.61,5.69 v71.48,7.82 69.7,7.82 v66.14,4.27 65.43,4.98 v54.94,4.98
VBAT  (via drill 0.35)
  Top 0.152: v93.52,7.82 94.06,8.36 94.06,8.89 C17.1 94.06,9.07 93.17,9.07 91.21,11.02 88.19,11.02 84.63,14.58 84.63,19.56 v83.03,21.16 | v92.1,7.82 91.21,8.71 R44.2 91.21,8.89 90.32,9.78 82.32,9.78 79.48,6.93 L1.P$1 79.48,6.76 82.68,3.56 88.72,3.56 89.43,2.85 93.17,2.85 IC5.5 | v85.34,33.78 85.34,34.31 84.81,34.85 C27.1 | R40.1 87.3,30.58 v87.3,31.83 91.21,31.83 v93.52,34.14 | v80.9,32.89 80.37,32.89 76.45,36.8 76.45,38.05 77.52,39.12 77.52,41.6 IC2.3 | v108.81,39.83 101.52,39.83 101.17,39.47 100.46,39.47 R1.2
  Bottom 0.152: v92.1,7.82 v93.52,7.82 | v87.3,31.83 v85.34,33.78 84.45,32.89 83.03,32.89 | 83.03,32.89 v80.9,32.89 | J7.1 120.37,34.67 116.64,34.67 111.48,39.83 v108.81,39.83 107.39,41.25 98.15,41.25 97.79,40.89 97.79,39.83 93.52,35.56 v93.52,34.14 | 83.03,32.89 v83.03,21.16
VGND
  Top 0.152: IC4.5 111.12,30.23 111.12,29.69 110.41,28.98 109.53,28.98 108.81,29.69 108.81,30.23 IC4.3 108.81,30.4 108.81,33.43 109.53,34.14 | R51.1 106.86,42.49 107.75,43.38 109.7,43.38 110.59,42.49 R52.2 110.59,42.32 110.59,38.05 108.81,36.27 108.81,35.74 IC4.12 108.81,35.56 108.81,34.85 109.53,34.14 | 109.53,34.14 110.41,34.14 111.12,34.85 111.12,35.56 IC4.10

### Text on the board
tNames: Analog-Mixer-OPA4134-K / 2018 Ali Momeni @ Pittsburgh